# Altium schematic sheet Main.SchDoc
size A4; SheetNumber: 2; SheetTotal: 15
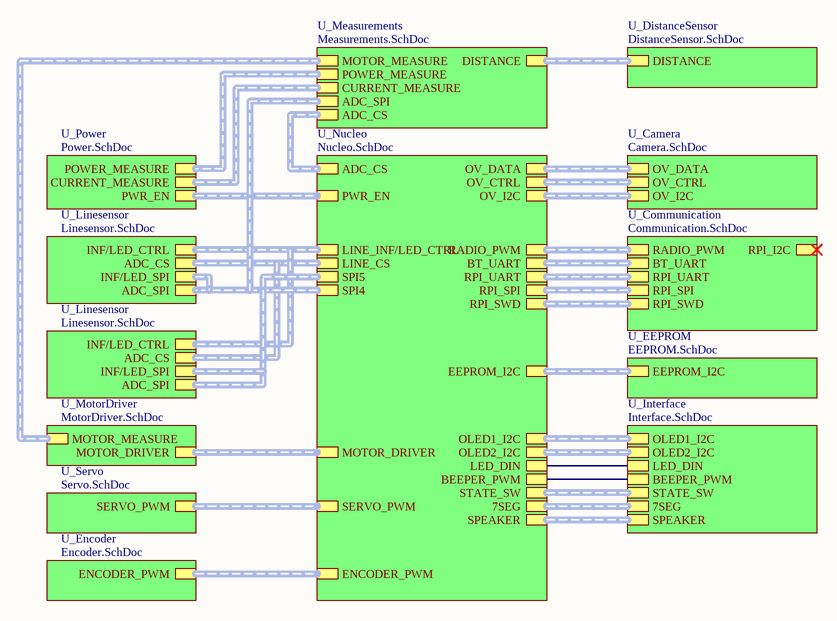
[diagram p0: Main.SchDoc]

## Sub-sheets
U_Camera = Camera.SchDoc: OV_DATA (harness OV_DATA), OV_I2C (harness OV_I2C), OV_CTRL (harness OV_CTRL)
U_Communication = Communication.SchDoc: BT_UART (harness BT_UART), RADIO_PWM (harness RADIO_PWM), RPI_I2C (harness RPi_I2C), RPI_UART (harness RPI_UART), RPI_SPI (harness RPi SPI), RPI_SWD (harness RPI_SWD)
U_DistanceSensor = DistanceSensor.SchDoc: DISTANCE (harness DISTANCE)
U_EEPROM = EEPROM.SchDoc: EEPROM_I2C (harness EEPROM_I2C)
U_Encoder = Encoder.SchDoc: ENCODER_PWM (harness ENCODER_PWM)
U_Interface = Interface.SchDoc: LED_DIN, BEEPER_PWM, STATE_SW, 7SEG, OLED1_I2C (harness OLED1), OLED2_I2C (harness OLED2), SPEAKER (harness SPEAKER)
U_Linesensor = Linesensor.SchDoc: INF/LED_CTRL (harness harness_line_inf), ADC_SPI (harness harness_spi), ADC_CS (harness harness_adc_cs), INF/LED_SPI (harness harness_spi)
U_Linesensor = Linesensor.SchDoc: INF/LED_CTRL (harness harness_line_inf), ADC_SPI (harness harness_spi), ADC_CS (harness harness_adc_cs), INF/LED_SPI (harness harness_spi)
U_Measurements = Measurements.SchDoc: POWER_MEASURE (harness POWER_MEASURE), DISTANCE (harness DISTANCE), MOTOR_MEASURE (harness MOTOR_MEASURE), ADC_SPI (harness ADC_SPI), ADC_CS (harness ADC_CS), CURRENT_MEASURE (harness CURRENT_MEASURE)
U_MotorDriver = MotorDriver.SchDoc: MOTOR_DRIVER (harness MOTOR_DRIVER), MOTOR_MEASURE (harness MOTOR_MEASURE)
U_Nucleo = Nucleo.SchDoc: OV_DATA (harness OV_DATA), LINE_INF/LED_CTRL (harness harness_line_inf), LINE_CS (harness harness_adc_cs), OV_CTRL (harness OV_CTRL), OV_I2C (harness OV_I2C), ENCODER_PWM (harness ENCODER_PWM), RADIO_PWM (harness RADIO_PWM), BT_UART (harness BT_UART), RPI_SPI (harness RPi SPI), RPI_UART (harness RPI_UART), PWR_EN (harness PWR_EN), SERVO_PWM (harness SERVO_PWM), MOTOR_DRIVER (harness MOTOR_DRIVER), LED_DIN, BEEPER_PWM, STATE_SW, 7SEG, RPI_SWD (harness RPI_SWD), EEPROM_I2C (harness EEPROM_I2C), OLED1_I2C (harness OLED1), OLED2_I2C (harness OLED2), SPEAKER (harness SPEAKER), ADC_CS (harness ADC_CS), SPI4 (harness harness_spi), SPI5 (harness harness_spi)
U_Power = Power.SchDoc: PWR_EN (harness PWR_EN), POWER_MEASURE (harness POWER_MEASURE), CURRENT_MEASURE (harness CURRENT_MEASURE)
U_Servo = Servo.SchDoc: SERVO_PWM (harness SERVO_PWM)

## Nets
(unnamed): sheet U_Interface/LED_DIN, sheet U_Nucleo/LED_DIN
(unnamed): sheet U_Interface/BEEPER_PWM, sheet U_Nucleo/BEEPER_PWM

## Buses and harness runs
harness sheet U_Camera/OV_CTRL = sheet U_Nucleo/OV_CTRL
harness sheet U_Camera/OV_DATA = sheet U_Nucleo/OV_DATA
harness sheet U_Camera/OV_I2C = sheet U_Nucleo/OV_I2C
harness sheet U_Communication/BT_UART = sheet U_Nucleo/BT_UART
harness sheet U_Communication/RADIO_PWM = sheet U_Nucleo/RADIO_PWM
harness sheet U_Communication/RPI_SPI = sheet U_Nucleo/RPI_SPI
harness sheet U_Communication/RPI_SWD = sheet U_Nucleo/RPI_SWD
harness sheet U_Communication/RPI_UART = sheet U_Nucleo/RPI_UART
harness sheet U_DistanceSensor/DISTANCE = sheet U_Measurements/DISTANCE
harness sheet U_EEPROM/EEPROM_I2C = sheet U_Nucleo/EEPROM_I2C
harness sheet U_Encoder/ENCODER_PWM = sheet U_Nucleo/ENCODER_PWM
harness sheet U_Interface/7SEG = sheet U_Nucleo/7SEG
harness sheet U_Interface/OLED1_I2C = sheet U_Nucleo/OLED1_I2C
harness sheet U_Interface/OLED2_I2C = sheet U_Nucleo/OLED2_I2C
harness sheet U_Interface/SPEAKER = sheet U_Nucleo/SPEAKER
harness sheet U_Interface/STATE_SW = sheet U_Nucleo/STATE_SW
harness sheet U_Linesensor/ADC_CS = sheet U_Nucleo/LINE_CS
harness sheet U_Linesensor/ADC_SPI = sheet U_Linesensor/INF/LED_SPI = sheet U_Measurements/ADC_SPI = sheet U_Nucleo/SPI4
harness sheet U_Linesensor/ADC_SPI = sheet U_Linesensor/INF/LED_SPI = sheet U_Nucleo/SPI5
harness sheet U_Linesensor/INF/LED_CTRL = sheet U_Nucleo/LINE_INF/LED_CTRL
harness sheet U_Measurements/ADC_CS = sheet U_Nucleo/ADC_CS
harness sheet U_Measurements/CURRENT_MEASURE = sheet U_Power/CURRENT_MEASURE
harness sheet U_Measurements/MOTOR_MEASURE = sheet U_MotorDriver/MOTOR_MEASURE
harness sheet U_Measurements/POWER_MEASURE = sheet U_Power/POWER_MEASURE
harness sheet U_MotorDriver/MOTOR_DRIVER = sheet U_Nucleo/MOTOR_DRIVER
harness sheet U_Nucleo/PWR_EN = sheet U_Power/PWR_EN
harness sheet U_Nucleo/SERVO_PWM = sheet U_Servo/SERVO_PWM

## Notes on the sheet
- Size
- Date
- A4
- Title
- Sheet number
- Author
- Revision